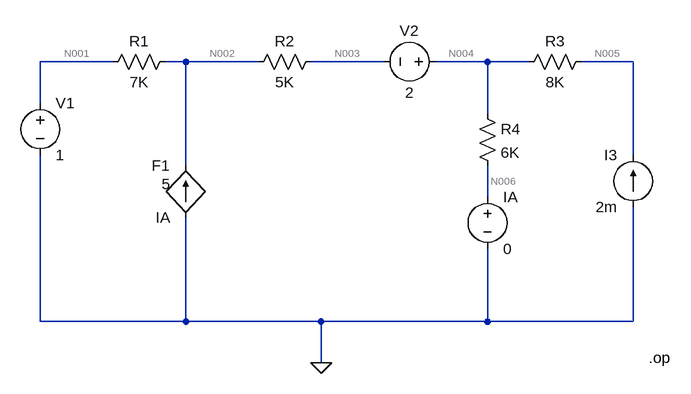
[diagram p0: schematic 77399306M.asc]
77399306M.asc, the LTspice schematic file:
Version 4.1
SHEET 1 880 680
WIRE -48 -192 -160 -192
WIRE 64 -192 32 -192
WIRE 176 -192 64 -192
WIRE 368 -192 256 -192
WIRE 528 -192 448 -192
WIRE 592 -192 528 -192
WIRE 752 -192 672 -192
WIRE -160 -128 -160 -192
WIRE 528 -112 528 -192
WIRE 752 -48 752 -192
WIRE 64 -32 64 -192
WIRE 528 16 528 -32
WIRE -160 208 -160 -48
WIRE 64 208 64 48
WIRE 64 208 -160 208
WIRE 272 208 64 208
WIRE 528 208 528 96
WIRE 528 208 272 208
WIRE 752 208 752 32
WIRE 752 208 528 208
WIRE 272 272 272 208
FLAG 272 272 0
SYMBOL voltage -160 -144 R0
WINDOW 123 0 0 Left 0
WINDOW 39 0 0 Left 0
SYMATTR InstName V1
SYMATTR Value 1
SYMBOL res 48 -208 R90
WINDOW 0 0 56 VBottom 2
WINDOW 3 32 56 VTop 2
SYMATTR InstName R1
SYMATTR Value 7K
SYMBOL voltage 464 -192 R90
WINDOW 0 -32 56 VBottom 2
WINDOW 3 32 56 VTop 2
WINDOW 123 0 0 Left 0
WINDOW 39 0 0 Left 0
SYMATTR InstName V2
SYMATTR Value 2
SYMBOL res 272 -208 R90
WINDOW 0 0 56 VBottom 2
WINDOW 3 32 56 VTop 2
SYMATTR InstName R2
SYMATTR Value 5K
SYMBOL res 512 -128 R0
SYMATTR InstName R4
SYMATTR Value 6K
SYMBOL current 752 32 R180
WINDOW 0 24 80 Left 2
WINDOW 3 24 0 Left 2
WINDOW 123 0 0 Left 0
WINDOW 39 0 0 Left 0
SYMATTR InstName I3
SYMATTR Value 2m
SYMBOL res 688 -208 R90
WINDOW 0 0 56 VBottom 2
WINDOW 3 32 56 VTop 2
SYMATTR InstName R3
SYMATTR Value 8K
SYMBOL f 64 48 R180
WINDOW 0 24 80 Left 2
WINDOW 3 24 0 Left 2
WINDOW 123 24 52 Left 2
SYMATTR InstName F1
SYMATTR Value IA
SYMATTR Value2 5
SYMBOL voltage 528 0 R0
WINDOW 123 0 0 Left 0
WINDOW 39 0 0 Left 0
SYMATTR InstName IA
SYMATTR Value 0
TEXT 776 264 Left 2 !.op

The netlist it stands for:
* 77399306M.asc
V1 N001 0 1
R1 N002 N001 7K
V2 N004 N003 2
R2 N003 N002 5K
R4 N004 N006 6K
I3 0 N005 2m
R3 N005 N004 8K
F1 0 N002 IA 5
V§IA N006 0 0
.op
.backanno
.end

* Results of the author's LTspice run, read from the files saved beside the schematic
* Operating Point:
*   V(n001) = 1 V
*   V(n002) = -29.47 V
*   V(n003) = -11.53 V
*   V(n004) = -9.529 V
*   V(n005) = 6.471 V
*   V(n006) = 0 V
*   I(F1) = -7.941 mA
*   I(I3) = 2 mA
*   I(IA) = -1.588 mA
*   I(R1) = -4.353 mA
*   I(R2) = 3.588 mA
*   I(R3) = 2 mA
*   I(R4) = -1.588 mA
*   I(V1) = -4.353 mA
*   I(V2) = 3.588 mA